# EAGLE schematic StepperSynth2.3_Motor (EAGLE 9.2.2)
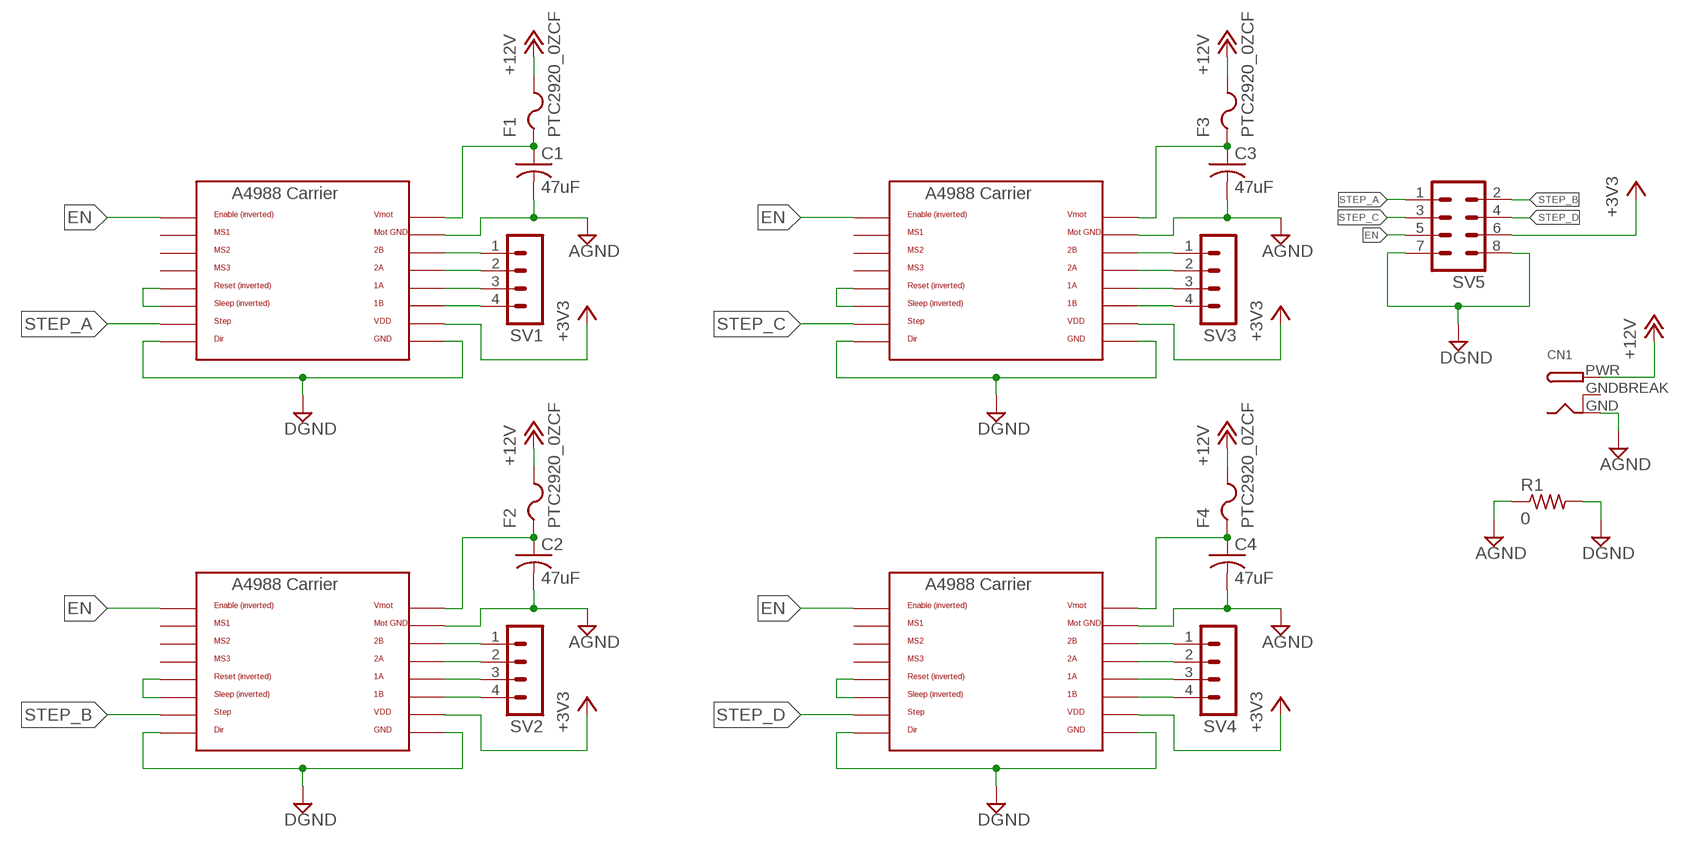
[diagram p0: schematic, sheet 1]

## Parts
C1  47uF  C_US_5_10  [E5-10]
C2  47uF  C_US_5_10  [E5-10]
C3  47uF  C_US_5_10  [E5-10]
C4  47uF  C_US_5_10  [E5-10]
CN1  DCBARRELPTH  [DCJACK_2MM_PTH]
F1  PTC2920_0ZCF  [0ZCF]
F2  PTC2920_0ZCF  [0ZCF]
F3  PTC2920_0ZCF  [0ZCF]
F4  PTC2920_0ZCF  [0ZCF]
R1  0  R-US_0204/5  [0204/5]
SV1  MA04-1  [MA04-1]
SV2  MA04-1  [MA04-1]
SV3  MA04-1  [MA04-1]
SV4  MA04-1  [MA04-1]
SV5  MA04-2  [MA04-2]
U$1  A4988BREAKOUT  [A4988BREAKOUT]
U$2  A4988BREAKOUT  [A4988BREAKOUT]
U$3  A4988BREAKOUT  [A4988BREAKOUT]
U$4  A4988BREAKOUT  [A4988BREAKOUT]

## Nets
+3V3: SV5.6 U$1.VDD U$2.VDD U$3.VDD U$4.VDD
+12V: CN1.PWR F1.2 F2.2 F3.2 F4.2
AGND: C1.- C2.- C3.- C4.- CN1.GND R1.1 U$1.MOTGND U$2.MOTGND U$3.MOTGND U$4.MOTGND
DGND: R1.2 SV5.7 SV5.8 U$1.DIR U$1.GND U$2.DIR U$2.GND U$3.DIR U$3.GND U$4.DIR U$4.GND
EN: SV5.5 U$1.EN U$2.EN U$3.EN U$4.EN
N$1: SV1.1 U$1.2B
N$2: SV1.2 U$1.2A
N$3: SV1.3 U$1.1A
N$4: SV1.4 U$1.1B
N$5: U$1.RST U$1.SLP(SLEEP)
N$6: C1.+ F1.1 U$1.VMOT
N$7: SV2.1 U$2.2B
N$8: SV2.2 U$2.2A
N$9: SV2.3 U$2.1A
N$10: SV2.4 U$2.1B
N$11: U$2.RST U$2.SLP(SLEEP)
N$12: C2.+ F2.1 U$2.VMOT
N$13: SV3.1 U$3.2B
N$14: SV3.2 U$3.2A
N$15: SV3.3 U$3.1A
N$16: SV3.4 U$3.1B
N$17: U$3.RST U$3.SLP(SLEEP)
N$18: C3.+ F3.1 U$3.VMOT
N$19: SV4.1 U$4.2B
N$20: SV4.2 U$4.2A
N$21: SV4.3 U$4.1A
N$22: SV4.4 U$4.1B
N$23: U$4.RST U$4.SLP(SLEEP)
N$24: C4.+ F4.1 U$4.VMOT
STEP_A: SV5.1 U$1.STEP
STEP_B: SV5.2 U$2.STEP
STEP_C: SV5.3 U$3.STEP
STEP_D: SV5.4 U$4.STEP
Unconnected: U$1.MS1 U$1.MS2 U$1.MS3 U$2.MS1 U$2.MS2 U$2.MS3 U$3.MS1 U$3.MS2 U$3.MS3 U$4.MS1 U$4.MS2 U$4.MS3

## Power pins joined to a net without a drawn wire
GNDBREAK: CN1.GNDBREAK

## Library data of the parts
C1-C4 = Capacitor:C_US_5_10: Capacitor 5mm lead Spacing, 10mm Diameter
CN1 = adafruit:DCBARREL: 2.0mm DC Barrel Jack DCJACK_2MM_PTH - Through Hole Jack (4UConnector: 05537)
F1-F4 = PTC Fuse - 0ZCF0150FF2C:PTC2920_0ZCF; MANUFACTURER_PART_NUMBER: 0ZCF0150FF2C; VENDOR: Belfuse
R1 = adafruit:R-US_: RESISTOR, American symbol
SV1-SV4 = con-lstb:MA04-1: PIN HEADER; OC_FARNELL: unknown; OC_NEWARK: unknown
SV5 = con-lstb:MA04-2: PIN HEADER; OC_FARNELL: unknown; OC_NEWARK: unknown
U$1-U$4 = RepRapjr:A4988BREAKOUT